# Altium schematic sheet INPUT&OUTPUT.SchDoc
size A4
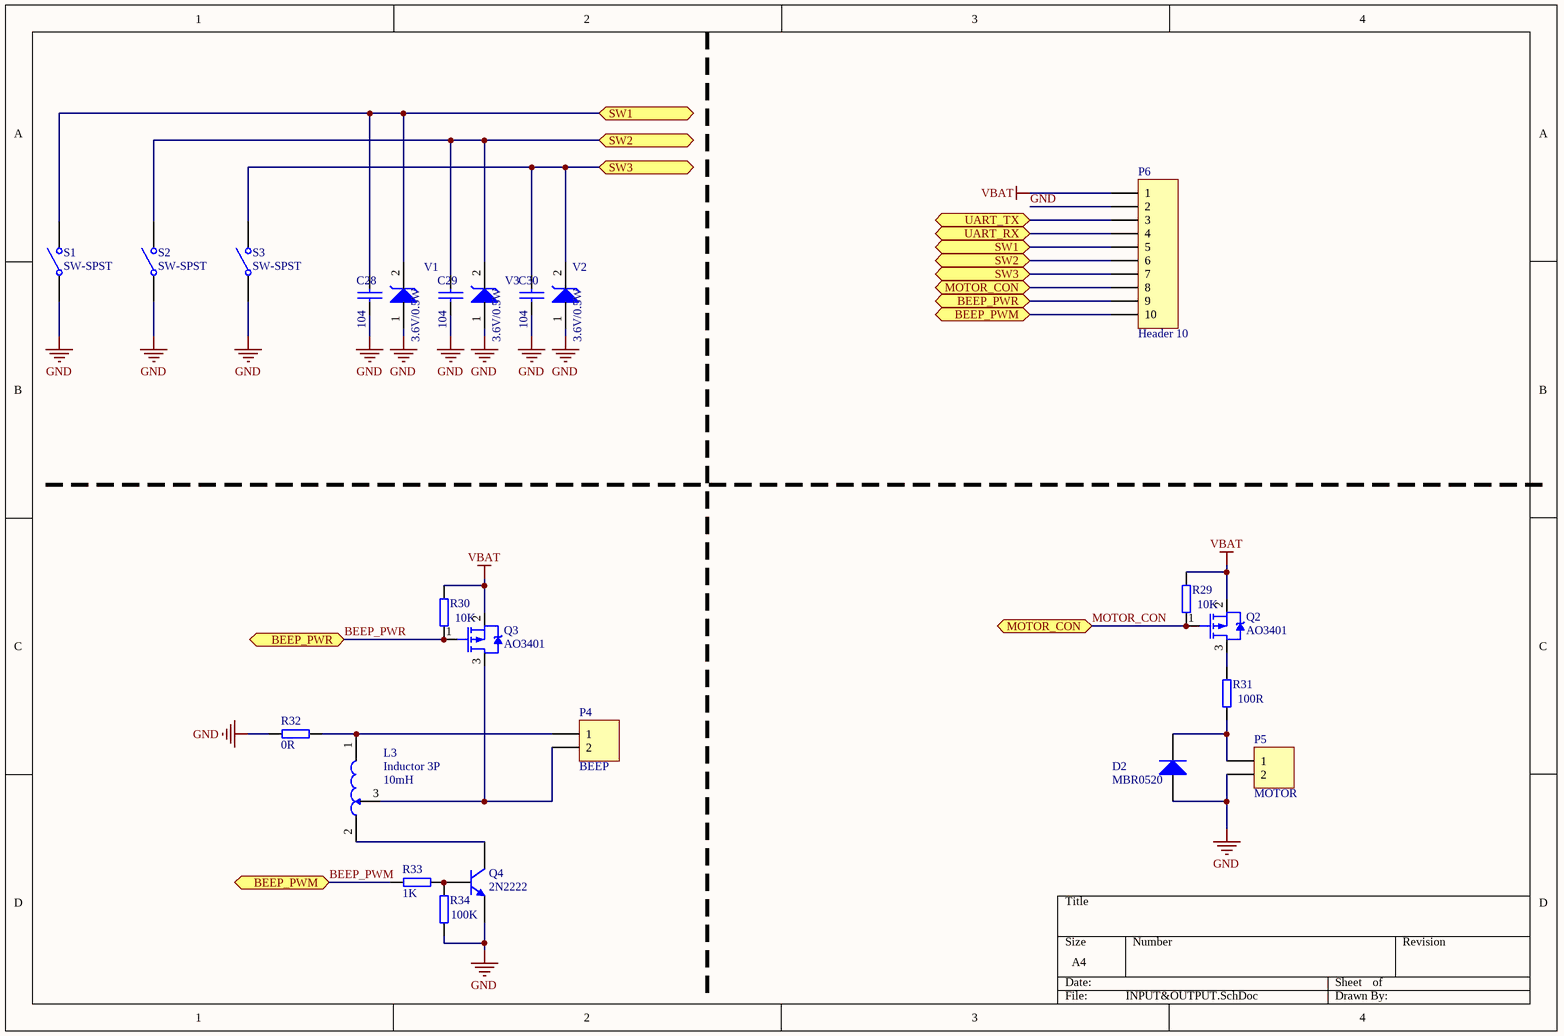
[diagram p0: INPUT&OUTPUT.SchDoc]

## Parts
C28  104  [0603C]
C29  104  [0603C]
C30  104  [0603C]
D2  MBR0520  [1206D]
L3  Inductor 3P  value 10mH  [HDR1X3 W]
P4  BEEP  [XH2.54-2P]
P5  MOTOR  [XH2.54-2P]
P6  Header 10  [HDR1X10]
Q2  AO3401  [sot23]
Q3  AO3401  [SOT23]
Q4  2N2222  [sot23]
R29  10K  [0603R]
R30  10K  [0603R]
R31  100R  [0603R]
R32  0R  [0603R]
R33  1K  [0603R]
R34  100K  [0603R]
S1  SW-SPST  [XH2.54-2P]
S2  SW-SPST  [XH2.54-2P]
S3  SW-SPST  [XH2.54-2P]
V1  3.6V/0.5W  [1206D]
V2  3.6V/0.5W  [1206D]
V3  3.6V/0.5W  [1206D]

## Ports
BEEP_PWM, BEEP_PWR, MOTOR_CON, SW1, SW2, SW3, UART_RX, UART_TX

## Nets
GND: C28.2 C29.2 C30.2 D2.1(A) P5.2 P6.2 Q4.1(E) R32.1 R34.2 S1.1(COMMON) S2.1(COMMON) S3.1(COMMON) V1.1 V2.1 V3.1
VBAT: P6.1 Q2.2(S) Q3.2(S) R29.1 R30.1
BEEP_PWM: P6.10 R33.1 ; port BEEP_PWM
BEEP_PWR: P6.9 Q3.1(G) R30.2 ; port BEEP_PWR
MOTOR_CON: P6.8 Q2.1(G) R29.2 ; port MOTOR_CON
SW1: C28.1 P6.5 S1.2(NO) V1.2 ; port SW1
SW2: C29.1 P6.6 S2.2(NO) V3.2 ; port SW2
SW3: C30.1 P6.7 S3.2(NO) V2.2 ; port SW3
UART_RX: P6.4 ; port UART_RX
UART_TX: P6.3 ; port UART_TX
NetD2_2: D2.2(K) P5.1 R31.2
NetL3_1: L3.1 P4.1 R32.2
NetL3_2: L3.2 Q4.3(C)
NetL3_3: L3.3 P4.2 Q3.3(D)
NetQ2_3: Q2.3(D) R31.1
NetQ4_2: Q4.2(B) R33.2 R34.1

## Library data of the parts
C28-C30 = 0603C
D2 = Diode: Default Diode; Published: 8-Jun-2000; LatestRevisionDate: 17-Jul-2002; LatestRevisionNote: Re-released for DXP Platform.; PackageDocument: Sep-1996; PackageReference: SMC; Publisher: Altium Limited; Code_JEDEC: DO-214-AB
L3 = Inductor 3P: Adjustable Magnetic-Core Inductor; Set Position: 0.5; Published: 24-Mar-1999; LatestRevisionDate: 17-Jul-2002; LatestRevisionNote: Re-released for DXP Platform.; PackageReference: AXIAL-1.0; Publisher: Altium Limited; PackageDescription: Axial Device, Thru-Hole; 2 Leads; 1.0 in Pin Spacing
P4 P5 = MHDR1X2: Header, 2-Pin; LatestRevisionDate: 17-Jul-2002; LatestRevisionNote: Re-released for DXP Platform.; Publisher: Altium Limited
P6 = Header 10: Header, 10-Pin; LatestRevisionDate: 17-Jul-2002; LatestRevisionNote: Re-released for DXP Platform.; Publisher: Altium Limited
Q2 Q3 = IRF5NJ5305: HEXFET Power MOSFET; Published: *; DatasheetDocument: *; PackageDocument: *; PackageReference: *; Publisher: *
Q4 = 2N3904: NPN General Purpose Amplifier; Published: 8-Jun-2000; LatestRevisionDate: 15-Jan-2003; LatestRevisionNote: PCB Footprint 'BCY-W3/D4.7' replaced; DatasheetDocument: 1997; PackageDocument: Sep-1998; PackageReference: TO-92A; Publisher: Altium Limited; Code_JEDEC: TO-92A; ComponentLink1Description: Manufacturer Link; ComponentLink1URL: http://www.fairchildsemi.com/; ComponentLink2Description: Datasheet; ComponentLink2URL: http://www.fairchildsemi.com/ds/2N%2F2N3904.pdf
R29-R34 = RES2A
S1-S3 = SW-SPST: Single-Pole, Single-Throw Switch; Published: 24-Mar-1999; LatestRevisionDate: 17-Jul-2002; LatestRevisionNote: Re-released for DXP Platform.; PackageReference: SPST-2; Publisher: Altium Limited; PackageDescription: Switch; 2 Leads
V1-V3 = DIODE-SCHOTTKY: DIODE SCHOTTKY